# EAGLE design IRRx (EAGLE 9.5.1)
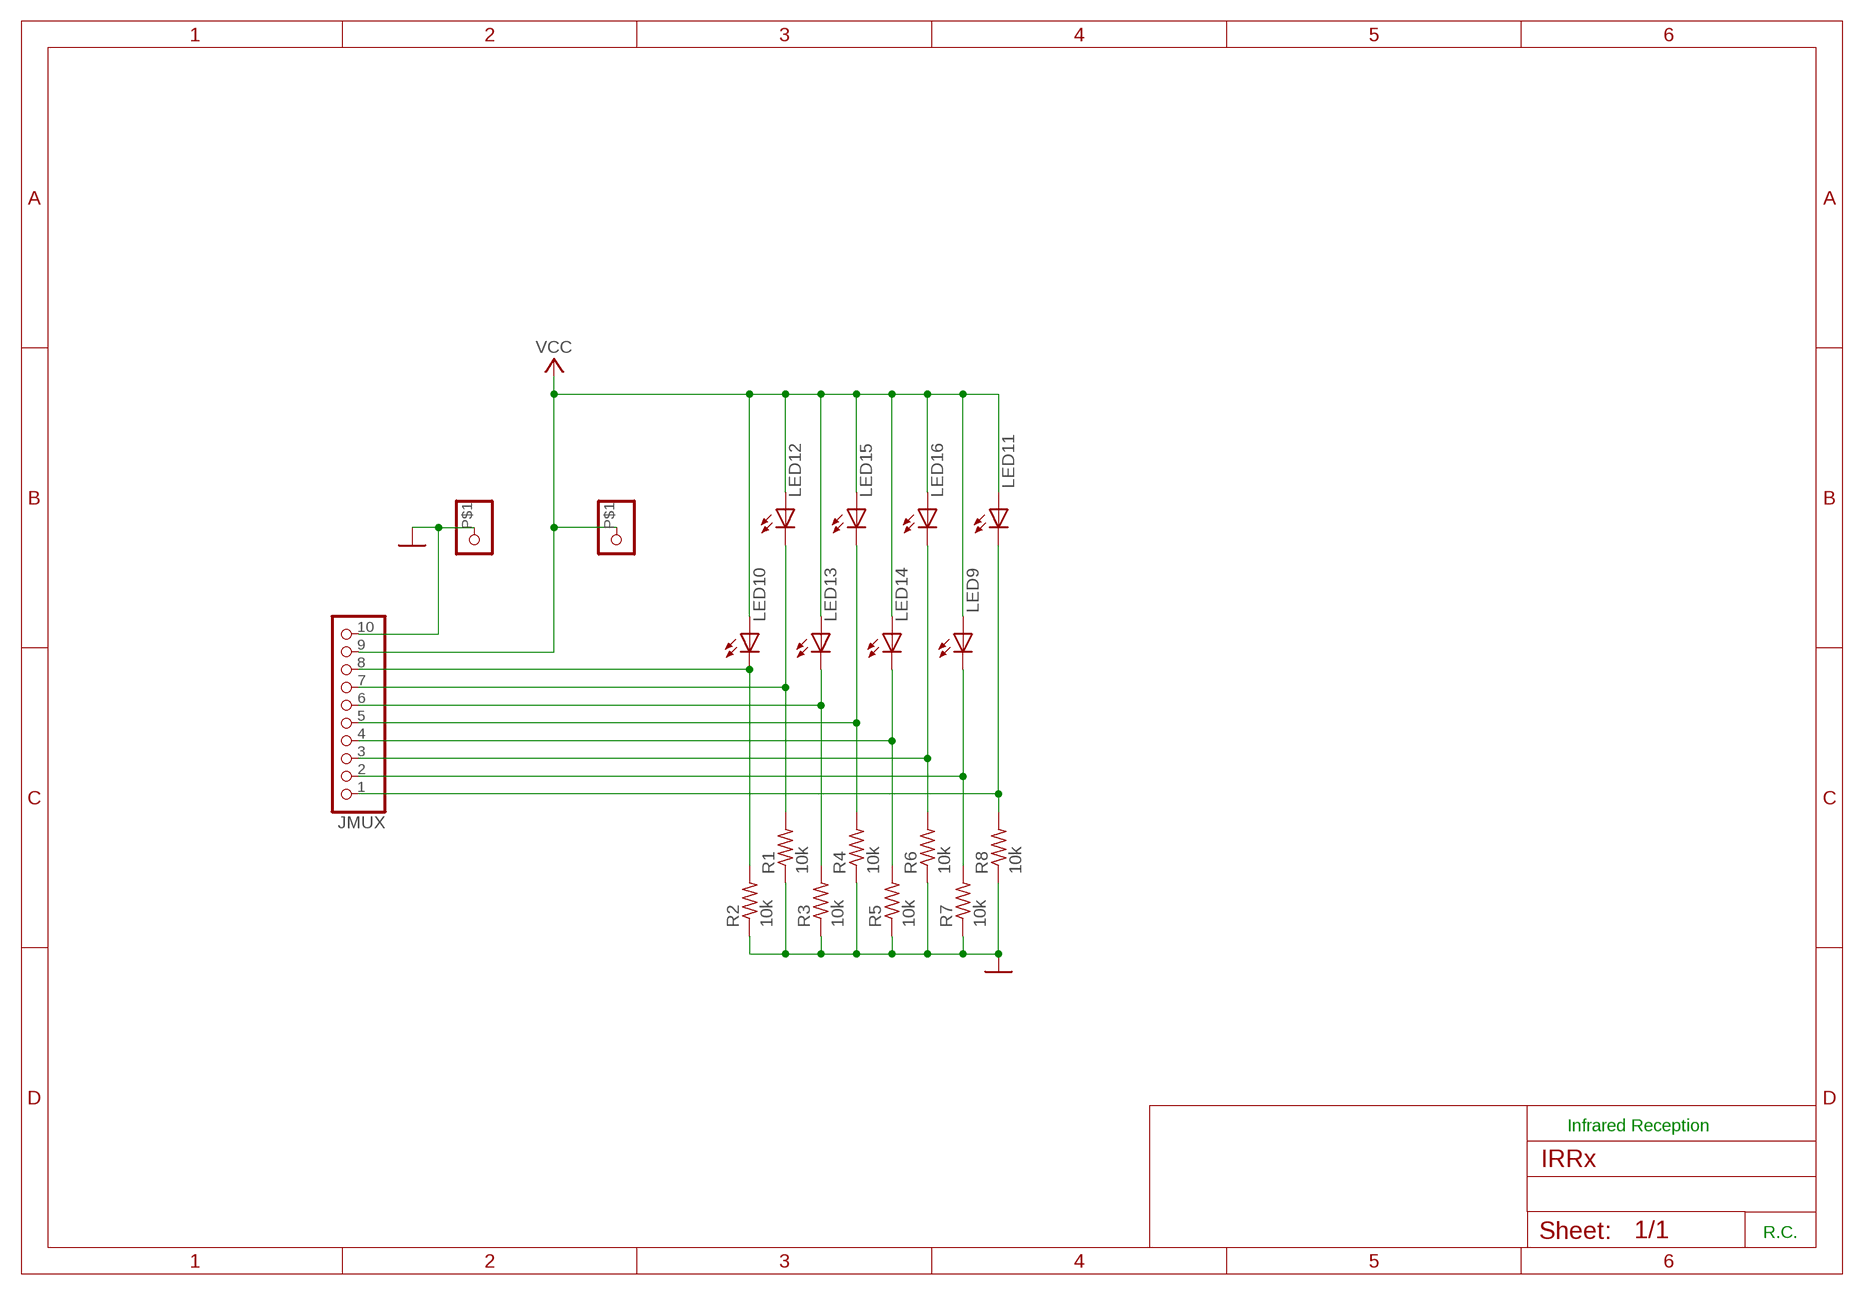
[diagram p0: schematic, sheet 1]

## Parts
JMUX  PINHD-1X10  [1X10-BIG]
JP1  3.3  PINHD-1X1-BIGPOGO  [1X1-BIGPOGO]
JP2  GND  PINHD-1X1-BIGPOGO  [1X1-BIGPOGO]
LED9  LED5MM  [LED5MM]
LED10  LED5MM  [LED5MM]
LED11  LED5MM  [LED5MM]
LED12  LED5MM  [LED5MM]
LED13  LED5MM  [LED5MM]
LED14  LED5MM  [LED5MM]
LED15  LED5MM  [LED5MM]
LED16  LED5MM  [LED5MM]
R1  10k  R-US_0207/10  [0207/10]
R2  10k  R-US_0207/10  [0207/10]
R3  10k  R-US_0207/10  [0207/10]
R4  10k  R-US_0207/10  [0207/10]
R5  10k  R-US_0207/10  [0207/10]
R6  10k  R-US_0207/10  [0207/10]
R7  10k  R-US_0207/10  [0207/10]
R8  10k  R-US_0207/10  [0207/10]

## Nets
GND: JMUX.10 JP2.P$1 R1.1 R2.1 R3.1 R4.1 R5.1 R6.1 R7.1 R8.1
N$1: JMUX.8 LED10.K(C) R2.2
N$2: JMUX.7 LED12.K(C) R1.2
N$3: JMUX.6 LED13.K(C) R3.2
N$4: JMUX.5 LED15.K(C) R4.2
N$5: JMUX.4 LED14.K(C) R5.2
N$6: JMUX.3 LED16.K(C) R6.2
N$7: JMUX.2 LED9.K(C) R7.2
N$8: JMUX.1 LED11.K(C) R8.2
VCC: JMUX.9 JP1.P$1 LED9.A LED10.A LED11.A LED12.A LED13.A LED14.A LED15.A LED16.A

## Notes on the sheet
- Infrared Reception
- R.C.

## Library data of the parts
JMUX = adafruit:PINHD-1X10: Pin header 1x10 0.1" spacing With round pins
JP1 JP2 = adafruit:PINHD-1X1: Pin header 1x1 for 0.1" spacing With round pins
LED9-LED16 = adafruit:LED: LED OSRAM: - CHIPLED LG R971, LG N971, LY N971, LG Q971, LY Q971, LO R971, LY R971 LH N974, LH R974 LS Q976, LO Q976, LY Q976 LO Q996 - Hyper CHIPLED LW Q18S LB Q993, LB Q99A, LB R99A - SideLED LS A670, LO A670, LY A670, LG A670, LP A670 LB A673, LV A673, LT A673, LW A673 LH A674 LY A675 LS A676, LA A676, LO A676, LY A676, LW A676 LS A679, LY A679, LG A679 - Hyper Micro SIDELED® LS Y876, LA Y876, LO Y876, LY Y876 LT Y87S - SmartLED LW L88C, LW L88S LB L89C, LB L89S, LG L890 LS L89K, LO L89K, LY L89K LS L896, LA L896, LO L896, LY L896 - TOPLED LS T670, LO T670, LY T670, LG T670, LP T670 LSG T670, LSP T670, LSY T670, LOP T670, LYG T670 LG T671, LOG T671, LSG T671 LB T673, LV T673, LT T673, LW T673 LH T674 LS T676, LA T676, LO T676, LY T676, LB T676, LH T676, LSB T676, LW T676 LB T67C, LV T67C, LT T67C, LS T67K, LO T67K, LY T67K, LW E67C LS E67B, LA E67B, LO E67B, LY E67B, LB E67C, LV E67C, LT E67C LW T67C LS T679, LY T679, LG T679 LS T770, LO T770, LY T770, LG T770, LP T770 LB T773, LV T773, LT T773, LW T773 LH T774 LS E675, LA E675, LY E675, LS T675 LS T776, LA T776, LO T776, LY T776, LB T776 LHGB T686 LT T68C, LB T68C - Hyper Mini TOPLED® LB M676 - Mini TOPLED Santana® LG M470 LS M47K, LO M47K, LY M47K Source: http://www.osram.convergy.de/
R1-R8 = adafruit:R-US_: RESISTOR, American symbol

## Board
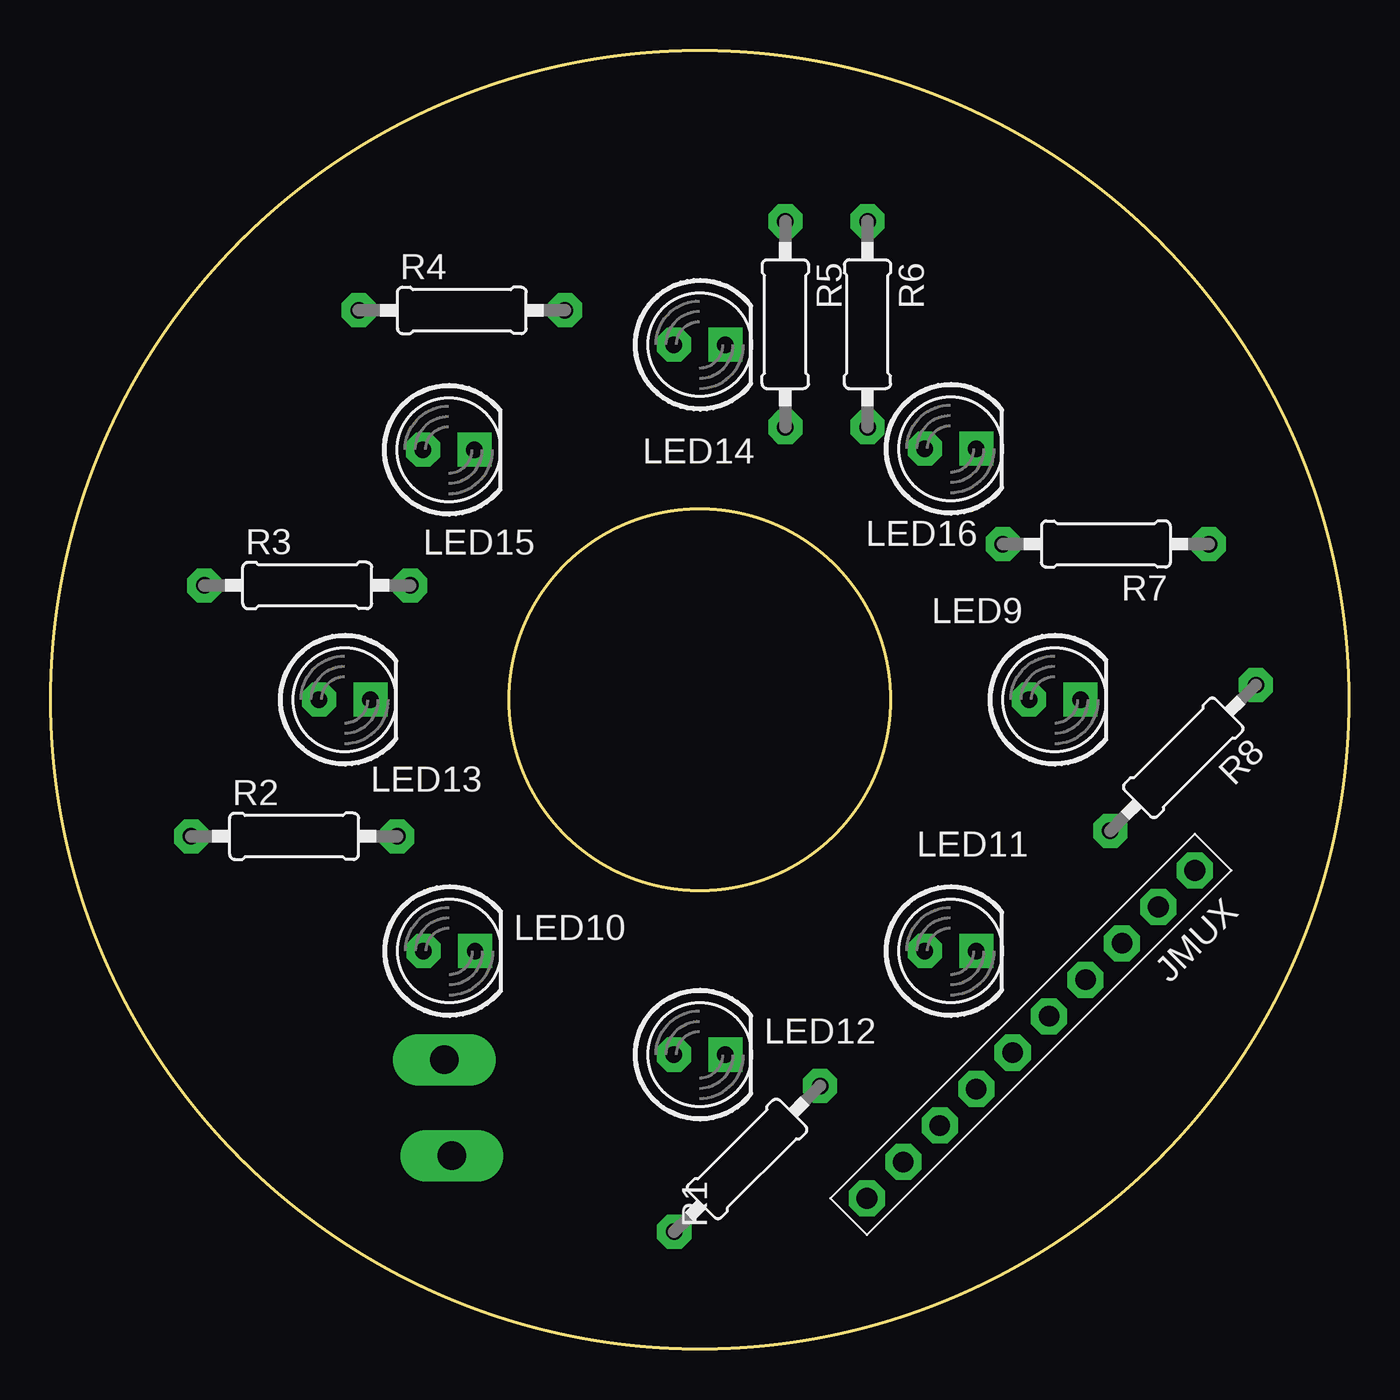
[diagram p1: board, top side]
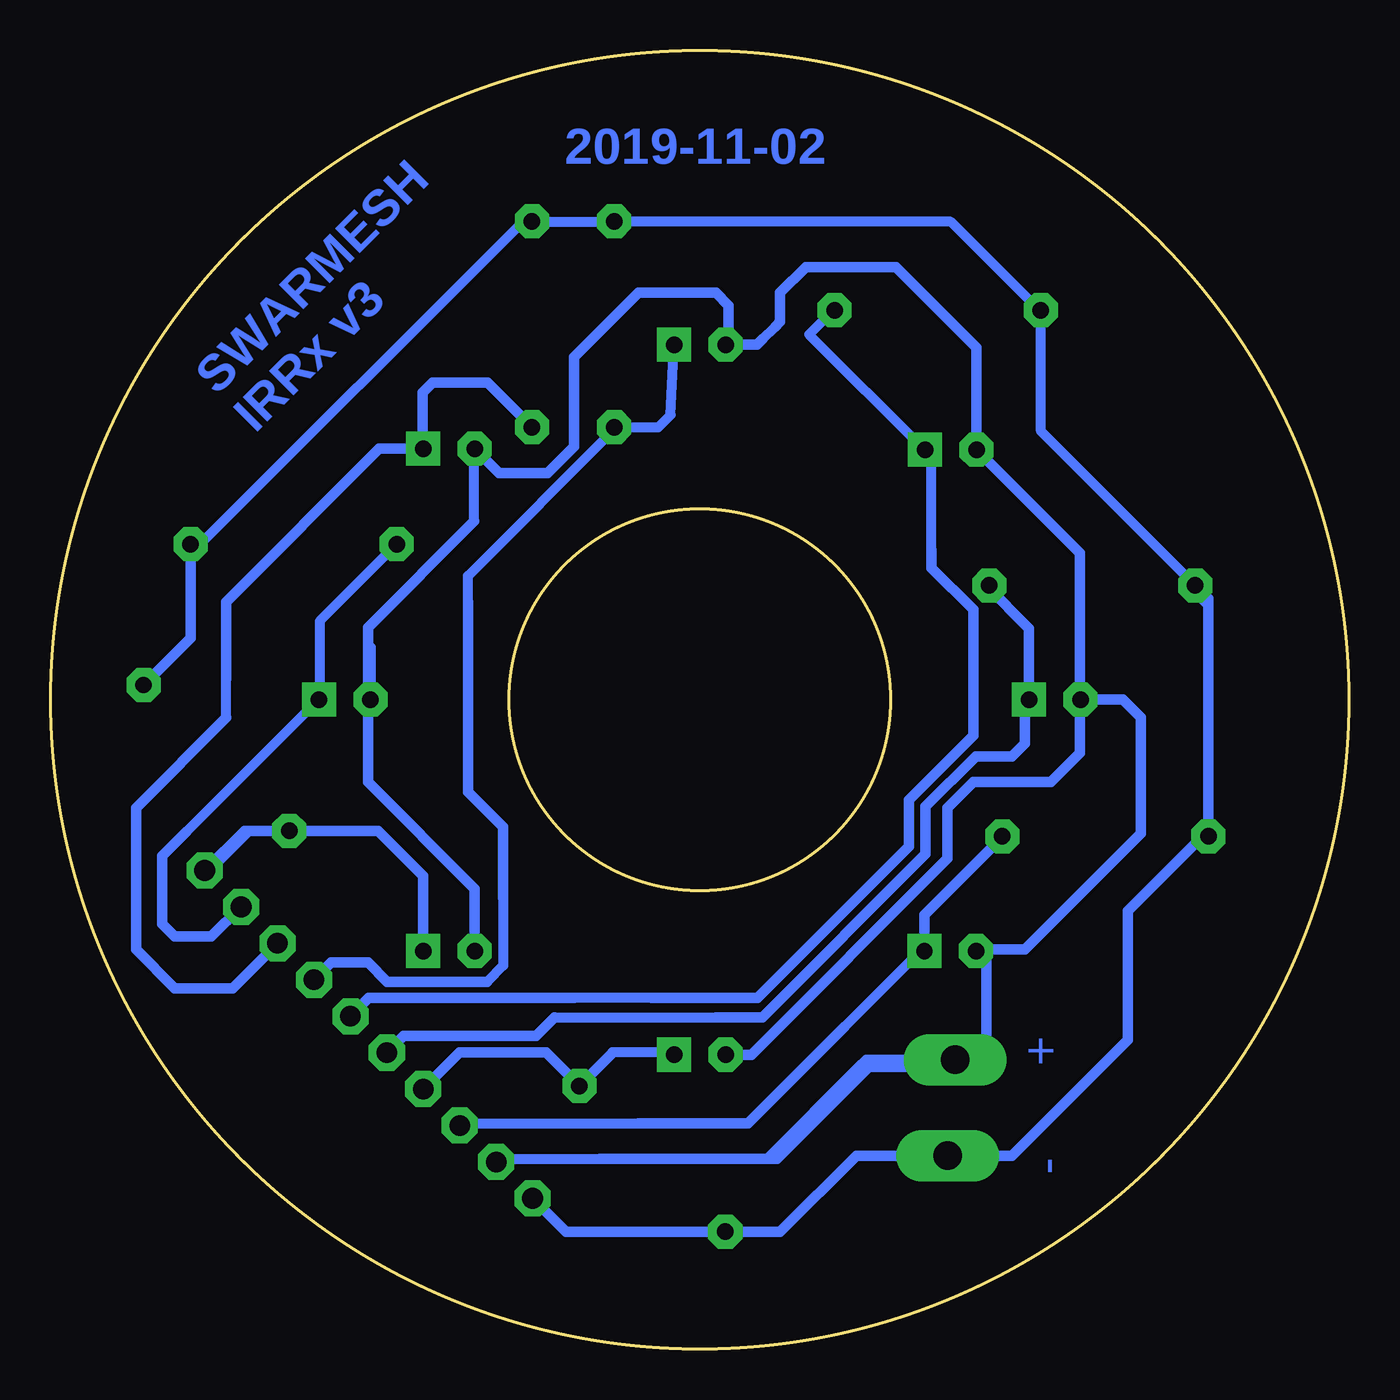
[diagram p2: board, bottom side, seen from below]

Size 64 x 64 mm. Coordinates in mm from the lower left corner, seen from the top.
Outline: circle at 32,32 radius 32
Outline: circle at 32,32 radius 9.4
Copper layers (1*16): Top 0.035mm / dielectric 1.5mm / Bottom 0.035mm
Design rules "default *": minimum track width 20mil, minimum drill 0.7mm, track to track 12mil, track to pad 12mil, pad to pad 12mil, via to via 12mil, smd to smd 6mil, copper to edge 40mil, drill to drill 6mil, minimum pad ring 10mil, minimum via ring 8mil, stop-mask expansion 4mil, vias tented up to drill 0mil, thermal gap 10mil

### Footprints (pad centres in the part's own frame; a part is rotated, then mirrored left to right if it is on the bottom)
1X10-BIG = drill 1.016 pad 1.778 octagon: 1 -11.43,0; 2 -8.89,0; 3 -6.35,0; 4 -3.81,0; 5 -1.27,0; 6 1.27,0; 7 3.81,0; 8 6.35,0; 9 8.89,0; 10 11.43,0
1X1-BIGPOGO = drill 1.4 pad 2.54 long: P$1 0,0
LED5MM = drill 0.813 pad 1.676 octagon: A -1.27,0 | drill 0.813 pad 1.676 square: K 1.27,0
0207/10 = drill 0.813 pad 1.676 octagon: 1 -5.08,0; 2 5.08,0

### Placement (x,y rotation side)
JMUX  48.33,15.5 225 top
JP1  19.41,14.26 0 top
JP2  19.78,9.53 0 top
LED9  49.5,32 0 top
LED10  19.65,19.61 0 top
LED11  44.37,19.61 0 top
LED12  32,14.5 0 top
LED13  14.5,32 0 top
LED14  32,49.5 0 top
LED15  19.63,44.32 0 top
LED16  44.37,44.37 0 top
R1  34.34,9.37 45 top
R2  12,25.27 0 top
R3  12.65,37.63 0 top
R4  20.27,51.2 0 top
R5  36.22,50.51 270 top
R6  40.27,50.51 270 top
R7  52.02,39.67 180 top
R8  55.83,29.14 225 top

### Tracks (layer width: path | path; a pad name or v marks a point on that pad's centre or on a via)
GND
  Bottom 0.305: 7.73,37.48 R3.1
  Bottom 0.5: R7.1 56.77,39.53 40.89,55.4 40.42,55.4 R6.1 40.26,55.56 36.29,55.56 R5.1 35.97,55.56 19.62,55.56 15.34,51.28 R4.1 15.18,51.12 15.18,45.24 7.71,37.78 R3.1
  Bottom 0.508: R2.1 6.92,36.99 7.71,37.78 | JMUX.10 38.6,5.77 R1.1 28.04,5.77 24.28,9.53 JP2.P$1 16.61,9.53 10.89,15.24 10.89,21.59 7.21,25.27 R2.1 | R2.1 6.92,36.67 7.73,37.48 | R8.1 57.1,35.05 R7.1
N$1
  Bottom 0.5: 17.08,25.24 R2.2 | 35.02,11.11 43.75,11.11 JMUX.8 | 24.86,15.88 21.05,19.68 LED10.K
  Bottom 0.508: 35.02,11.11 29.62,11.11 24.86,15.88 | LED10.K 20.92,21.4 17.08,25.24
N$2
  Bottom 0.5: 33.75,14.61 36.29,14.61
  Bottom 0.508: JMUX.7 43.83,14.61 39.58,14.61 R1.2 36.29,14.59 36.29,14.61 | LED12.K 33.37,14.61 33.75,14.61
N$3
  Bottom 0.5: 17.88,37.62 R3.2 | 39.15,16.35 31.21,16.35
  Bottom 0.508: 17.88,37.62 15.77,35.52 LED13.K 15.97,31.8 15.97,29.84 16.61,29.21 18.39,29.21 20.87,26.73 20.87,24.39 28.91,16.35 31.21,16.35 | JMUX.6 46.61,15.42 40.08,15.42 39.15,16.35
N$4
  Bottom 0.5: R4.2 25.5,51.12 26.61,50.01 21.05,44.45 LED15.K 20.73,44.13 20.57,43.97 20.57,39.37 | 34.38,17.3 38.2,17.3
  Bottom 0.508: 34.38,17.3 29.15,17.3 21.68,24.77 21.68,27.06 18.51,30.24 18.51,36.44 20.57,38.5 20.57,39.37 | 38.2,17.3 42.13,17.3 42.15,17.29 48.33,17.29 JMUX.5
N$5
  Bottom 0.5: LED14.K 33.43,46.04 34.03,45.44 R5.2 36.29,45.24 43.43,38.1 43.43,36.83 43.43,35.72 | 42.48,18.1 41.69,18.89 41.69,22.23 41.69,22.86
  Bottom 0.508: 41.69,22.23 41.69,25.72 43.43,27.46 43.43,36.83 | JMUX.4 50.16,19.05 48.35,19.05 47.4,18.1 42.48,18.1
N$6
  Bottom 0.5: 42.32,47.47 40.42,45.56 R6.2 | 45.5,44.29 LED16.K 45.66,44.13 | 55.34,34.45 55.34,33.02 55.34,31.11
  Bottom 0.508: R6.2 42.46,47.62 45.18,47.62 45.66,47.15 45.66,44.13 | LED16.K 47.8,44.37 55.34,36.83 55.34,33.02 | JMUX.3 55.02,17.78 57.88,17.78 59.78,19.68 59.78,26.67 55.34,31.11
N$7
  Bottom 0.5: R7.2 47.09,39.53 50.74,35.88 50.74,32.07 LED9.K 50.9,31.91 57.32,25.48
  Bottom 0.508: 57.32,25.48 58.52,24.29 58.52,20.95 57.88,20.32 56.08,20.32 JMUX.2
N$8
  Bottom 0.508: R8.2 54.45,25.54 JMUX.1 56.32,23.5 56.29,23.5 54.24,25.54 R8.2 | R8.2 51.51,25.54 | 51.57,25.54 R8.2 | LED11.K 45.64,23.32 47.86,25.54 R8.2
VCC
  Bottom 0.5: 18.35,19.68 LED10.A 18.51,19.53 | 36.92,9.37 42.01,9.37 JMUX.9 | 43.12,40.8 43.12,44.29 LED16.A | 13.27,31.91 LED13.A 13.11,32.23 | 18.35,44.29 LED15.A 18.19,44.45 | 28.91,49.77 28.27,50.4
  Bottom 0.508: 36.92,9.37 28.67,9.37 | 28.67,9.37 24.15,13.89 | 24.15,13.89 19.22,13.89 19.14,13.97 17.88,13.97 17.88,19.68 | 17.88,19.68 18.35,19.68 | 17.88,19.68 15.97,19.68 10.26,25.4 10.26,31.11 11.14,32 LED13.A | LED11.A 43.1,22.68 48.35,27.94 48.35,31.88 | 48.35,31.88 LED9.A 48.23,34.58 | 43.12,40.8 48.35,35.56 48.35,31.88 | LED16.A 41.9,43.18 39.5,43.18 38.2,44.48 38.2,48.9 35.02,52.07 31.21,52.07 30.57,51.44 30.57,49.66 LED14.A 29.17,49.51 28.91,49.77 | 28.27,50.4 28.04,50.64 28.04,52.07 26.77,53.34 22.32,53.34 18.35,49.37 18.35,44.29 | LED15.A 13.27,39.24 13.27,31.91 13.27,29.37 14.7,27.94 18.51,27.94 19.78,26.67 19.78,24.18 29.46,14.5 LED12.A | 28.67,9.37 28.19,9.37 23.3,14.26 JP1.P$1 23.78,14.26 24.15,13.89

### Text on the board
Bottom: 2019-11-02 | SWARMESH / IRRx v3 | + | -